# EAGLE design Adafruit PCA9685 (EAGLE 8.2.2)
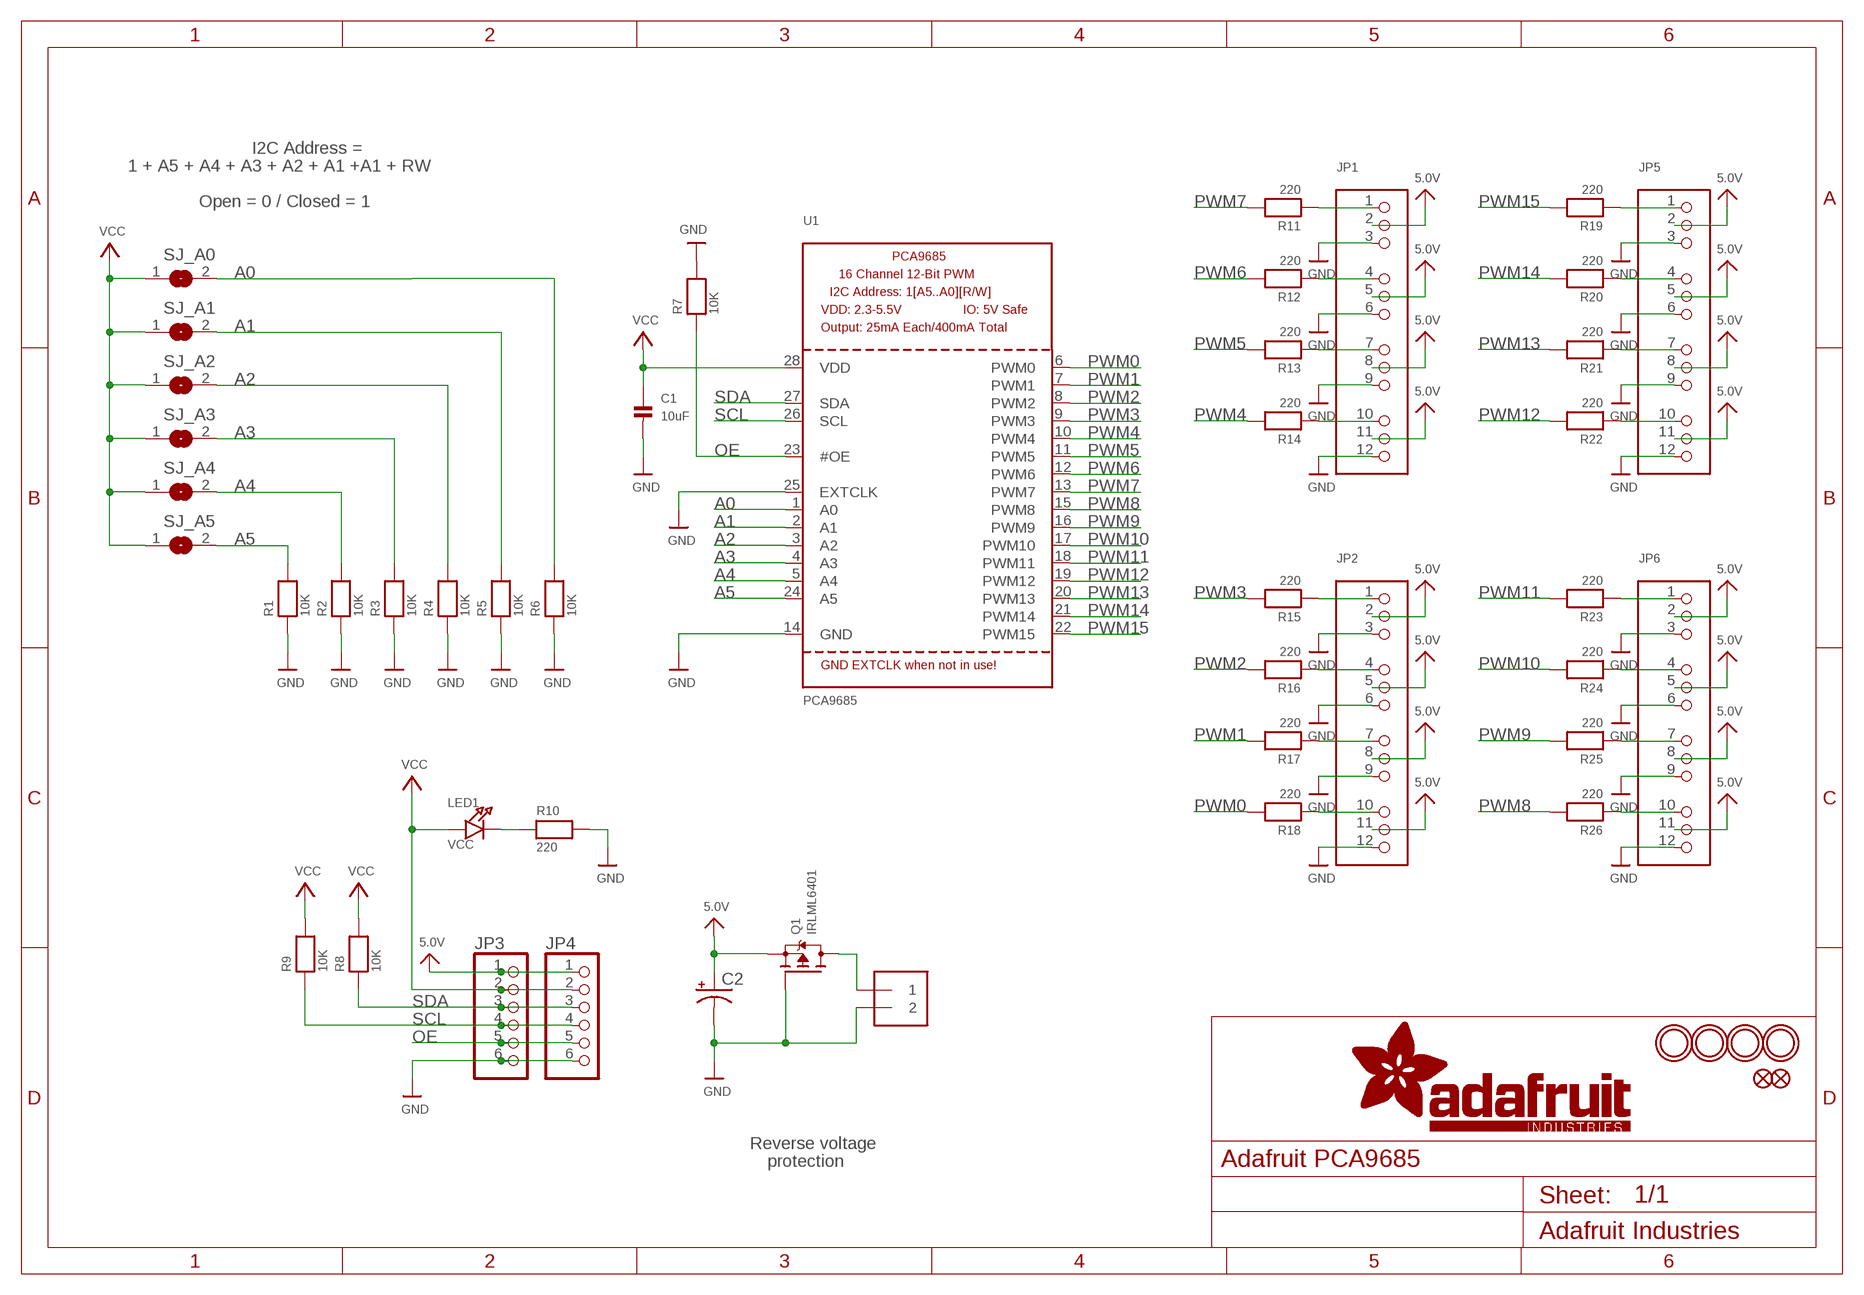
[diagram p0: schematic, sheet 1]

## Parts
C1  10uF  CAP_CERAMIC0805  [0805]
C2  CPOL-USE3.5-8  [E3,5-8]
FID1  FIDUCIAL""  [FIDUCIAL_1MM]
FID2  FIDUCIAL""  [FIDUCIAL_1MM]
J1  TERMBLOCK_1X2-3.5MM  [1X2-3.5MM]
JP1  HEADER-3X04  [3X04]
JP2  HEADER-3X04  [3X04]
JP3  PINHD-1X6CB  [1X06-CLEANBIG]
JP4  PINHD-1X6CB  [1X06-CLEANBIG]
JP5  HEADER-3X04  [3X04]
JP6  HEADER-3X04  [3X04]
LED1  VCC  LED0805  [CHIPLED_0805]
Q1  IRLML6401  MOSFET-PWIDE  [SOT23-WIDE]
R1  10K  RESISTOR0805  [0805]
R2  10K  RESISTOR0805  [0805]
R3  10K  RESISTOR0805  [0805]
R4  10K  RESISTOR0805  [0805]
R5  10K  RESISTOR0805  [0805]
R6  10K  RESISTOR0805  [0805]
R7  10K  RESISTOR0805  [0805]
R8  10K  RESISTOR0805  [0805]
R9  10K  RESISTOR0805  [0805]
R10  220  RESISTOR0805  [0805]
R11  220  RESISTOR0805  [0805]
R12  220  RESISTOR0805  [0805]
R13  220  RESISTOR0805  [0805]
R14  220  RESISTOR0805  [0805]
R15  220  RESISTOR0805  [0805]
R16  220  RESISTOR0805  [0805]
R17  220  RESISTOR0805  [0805]
R18  220  RESISTOR0805  [0805]
R19  220  RESISTOR0805  [0805]
R20  220  RESISTOR0805  [0805]
R21  220  RESISTOR0805  [0805]
R22  220  RESISTOR0805  [0805]
R23  220  RESISTOR0805  [0805]
R24  220  RESISTOR0805  [0805]
R25  220  RESISTOR0805  [0805]
R26  220  RESISTOR0805  [0805]
SJ_A0  SOLDERJUMPERREFLOW_NOPASTE  [SOLDERJUMPER_REFLOW_NOPASTE]
SJ_A1  SOLDERJUMPERREFLOW_NOPASTE  [SOLDERJUMPER_REFLOW_NOPASTE]
SJ_A2  SOLDERJUMPERREFLOW_NOPASTE  [SOLDERJUMPER_REFLOW_NOPASTE]
SJ_A3  SOLDERJUMPERREFLOW_NOPASTE  [SOLDERJUMPER_REFLOW_NOPASTE]
SJ_A4  SOLDERJUMPERREFLOW_NOPASTE  [SOLDERJUMPER_REFLOW_NOPASTE]
SJ_A5  SOLDERJUMPERREFLOW_NOPASTE  [SOLDERJUMPER_REFLOW_NOPASTE]
U1  PCA9685  [TSSOP28]
U$47  MOUNTINGHOLE2.5  [MOUNTINGHOLE_2.5_PLATED]
U$48  MOUNTINGHOLE2.5  [MOUNTINGHOLE_2.5_PLATED]
U$49  MOUNTINGHOLE2.5  [MOUNTINGHOLE_2.5_PLATED]
U$50  MOUNTINGHOLE2.5  [MOUNTINGHOLE_2.5_PLATED]

## Nets
5.0V: C2.+ JP1.2 JP1.5 JP1.8 JP1.11 JP2.2 JP2.5 JP2.8 JP2.11 JP3.1 JP4.1 JP5.2 JP5.5 JP5.8 JP5.11 JP6.2 JP6.5 JP6.8 JP6.11 Q1.2(S)
A0: R6.2 SJ_A0.2 U1.1(A0)
A1: R5.2 SJ_A1.2 U1.2(A1)
A2: R4.2 SJ_A2.2 U1.3(A2)
A3: R3.2 SJ_A3.2 U1.4(A3)
A4: R2.2 SJ_A4.2 U1.5(A4)
A5: R1.2 SJ_A5.2 U1.24(A5)
GND: C1.2 C2.- J1.2 JP1.3 JP1.6 JP1.9 JP1.12 JP2.3 JP2.6 JP2.9 JP2.12 JP3.6 JP4.6 JP5.3 JP5.6 JP5.9 JP5.12 JP6.3 JP6.6 JP6.9 JP6.12 Q1.1(G) R1.1 R2.1 R3.1 R4.1 R5.1 R6.1 R7.2 R10.2 U1.14(GND) U1.25(EXTCLK)
N$1: LED1.C R10.1
N$2: JP1.4 R12.1
N$3: JP1.1 R11.1
N$4: JP1.7 R13.1
N$5: JP1.10 R14.1
N$6: JP2.1 R15.1
N$7: JP2.4 R16.1
N$8: JP2.7 R17.1
N$9: JP2.10 R18.1
N$10: JP6.10 R26.1
N$11: JP6.7 R25.1
N$12: JP6.4 R24.1
N$13: JP6.1 R23.1
N$14: JP5.10 R22.1
N$15: JP5.7 R21.1
N$16: JP5.4 R20.1
N$17: JP5.1 R19.1
OE: JP3.5 JP4.5 R7.1 U1.23(#OE)
PWM0: R18.2 U1.6(PWM0)
PWM1: R17.2 U1.7(PWM1)
PWM2: R16.2 U1.8(PWM2)
PWM3: R15.2 U1.9(PWM3)
PWM4: R14.2 U1.10(PWM4)
PWM5: R13.2 U1.11(PWM5)
PWM6: R12.2 U1.12(PWM6)
PWM7: R11.2 U1.13(PWM7)
PWM8: R26.2 U1.15(PWM8)
PWM9: R25.2 U1.16(PWM9)
PWM10: R24.2 U1.17(PWM10)
PWM11: R23.2 U1.18(PWM11)
PWM12: R22.2 U1.19(PWM12)
PWM13: R21.2 U1.20(PWM13)
PWM14: R20.2 U1.21(PWM14)
PWM15: R19.2 U1.22(PWM15)
PWRIN: J1.1 Q1.3(D)
SCL: JP3.4 JP4.4 R9.1 U1.26(SCL)
SDA: JP3.3 JP4.3 R8.1 U1.27(SDA)
VCC: C1.1 JP3.2 JP4.2 LED1.A R8.2 R9.2 SJ_A0.1 SJ_A1.1 SJ_A2.1 SJ_A3.1 SJ_A4.1 SJ_A5.1 U1.28(VDD)

## Notes on the sheet
- I2C Address =
- 1 + A5 + A4 + A3 + A2 + A1 +A1 + RW
- Open = 0 / Closed = 1
- Reverse voltage
- protection

## Library data of the parts
C1 = microbuilder:CAP_CERAMIC: Ceramic Capacitors 0402 - 0402 Surface Mount Capacitors 16pF 50V 5% [Digikey: 445-4899-2-ND] 18pF 50V 5% [Digikey: 490-1281-2-ND] 22pF 50V 5% [Digikey: 490-1283-2-ND] 68pF 50V 5% [Digikey: 490-1289-2-ND] 0.1uF 10V 10% [Digikey: 490-1318-2-ND] 1.0uF 6.3V 10% [Digikey: 490-1320-2-ND] 0603 - 0603 Surface Mount Capacitors 16 pF 50V 5% [Digikey: 445-5051-2-ND] 22 pF 50V [Digikey: PCC220ACVTR-ND] 33 pF 50V 5% [Digikey: 490-1415-1-ND] 56pF 50V 5% [Digikey: 490-1421-1-ND] 220pF 50V 5% [Digikey: 445-1285-1-ND] 680 pF 50V 2200 pF 50V 5% C0G [Digikey: 445-1297-1-ND] 5600 pF 100V 5% X7R [Digikey: 478-3711-1-ND] 0.1 µF 25V 10% [Digikey: PCC2277TR-ND] 0.22 µF 16V 10% X7R [Digikey: 445-1318-1-ND] 1.0 µF 25V 10% [Digikey: 445-5146-2-ND] 0603 - RF Specific 3pF 250V +/-0.1pF RF [Digikey: 712-1347-1-ND] 18 pF 250V 5% [Digikey: 478-3505-1-ND or 712-1322-1-ND] 56 pF 250V 5% C0G RF [Digikey: 490-4867-1-ND] 68 pF 250V RF [Digikey: 490-4868-1-ND] 0805 - 0805 Surface Mount Capacitors 220 pF 250V 2% RF Ceramic Capacitor [Digikey: 712-1398-1-ND] 1000 pF 50V 2% NP0 Ceramic Capacitor [Digikey: 478-3760-1-ND] 0.1 µF 25V 10% Ceramic Capacitor [Digikey: PCC1828TR-ND] 1.0 µF 16V 10% Ceramic Capacitor[Digikey: 490-1691-2-ND] 10.0 µF 10V 10% Ceramic Capacitor[Digikey: 709-1228-1-ND] 10.0 uF 16V 10% Ceramic Capacitor [Digikey: 478-5165-2-ND] 47 uF 6.3V 20% Ceramic Capacitor [Digikey: 587-1779-1-ND or 399-5506-1-ND] 1206 - 1206 Surface Mount Capacitors 47uF 10V 20% Ceramic Capacitor [Digikey: 490-5528-1-ND or 399-5508-1-ND or 445-6010-1-ND] 100uF 6.3V -20%, +80% Y5V Ceramic Capacitor (Digikey: 490-4512-1-ND, Mouser: 81-GRM31CF50J107ZE1L)
C2 = adafruit:CPOL-US: POLARIZED CAPACITOR, American symbol
FID1 FID2 = microbuilder:FIDUCIAL: Fiducial Alignment Points Various fiducial points for machine vision alignment.
J1 = microbuilder:TERMBLOCK_1X2: 3.5mm Terminal block http://www.ladyada.net/library/pcb/eaglelibrary.html
JP1 JP2 JP5 JP6 = microbuilder:HEADER-3X04
JP3 JP4 = adafruit:PINHD-1X6: PIN HEADER
LED1 = microbuilder:LED: LED 0603 - 0603 Surface Mount Package 2mA: Green LED - Low Power (3.9mcd, 2ma, 1.7Vf) - Digikey: 475-2709-2-ND Orange LED - Low Power (9.8mcd, 2ma, 1.8Vf) - Digikey: 475-1194-2-ND Red LED - Low Power (5mcd, 2ma, 1.8Vf) - Digikey: 475-1195-2-ND Yellow LED - Low Power (7mcd, 2ma, 1.8Vf) - Digikey: 475-1196-2-ND 5mA: Blue LED - Low Power (17mcd, 5ma, 2.9Vf) - Digikey: LNJ937W8CRACT-ND 0805 - 0805 Surface Mount Package 2mA: Red LED (8.8mcd, 2mA, 1.8Vf, Clear) - Low Power [Digikey: 475-2510-1-ND] Green LED (5mcd, 2mA, 1.8Vf, Clear) - Low Power [Digikey: 475-2730-1-ND] Yellow LED (11.3mcd, 2mA, 1.8Vf, Clear) - Low Power [Digikey: 475-2555-1-ND] 20mA: Red LED (104mcd, 20mA, Diffused) - LS R976 [Digikey: 475-1278-6-ND] Red LED (12mcd, 20mA, 2.0Vf, Clear) - APT2012EC [Digikey: 754-1128-1-ND] Green LED (15mcd, 20mA, 2.2Vf, Clear) - APT2012GC [Digikey: 754-1131-1-ND] Orange LED (160mcd, 20mA, 2.1Vf, Clear) - APT2012SECK [Digikey: 754-1130-1-ND] 1206 - 1206 Surface Mount Package Green LED (26mcd, 20mA, Diffused) - LG N971 [Digikey: 475-1407-6-ND] Red LED (15mcd, 20mA, Diffused) - LH N974 [Digikey: 475-1416-6-ND]
Q1 = microbuilder:MOSFET-P: P-Channel Mosfet LEGEND VDS: Voltage Drain-Source ID: Drain Current RDS(ON): Drain-Source On-State Resistance VGS(TH): Gate-Source Threshold Voltage CISS: Drain-Source Input Capacitance SOT-23 Name VDS ID RDS(ON) VGS(TH) CISS Order Number IRLML5103 30V 760mA 600 mOhm -- 75pF @ 25V Digikey: IRLML5103PBFCT-ND NTR0202PL 20V 400mA 800 mOhm 2.3V @ 250uA 70pF @ 5V Digikey: NTR0202PLT1GOSTR-ND NTR4101PT1G 20V 1.8A 85 mOhm 1.2V @ 250uA 675pF @ 10V Digikey: NTR4101PT1GOSCT-ND DMP2004K 20V 600mA 900 mOhm 1V @ 250uA 175pF @ 16V Digikey: DMP2004KDICT-ND PMV65XP 20V 3.9A 76 mOhm 950mV @ 1mA 725pF @ 20V Digikey: 568-2358-2-ND TO-252 Name VDS ID RDS(ON) VGS(TH) CISS Order Number AOD417 30V 25A 34 mOhm 3V @ 250µA 920pF @ 15V Digikey: 785-1106-2-ND
R1-R26 = microbuilder:RESISTOR: Resistors 0402 - 0402 Surface Mount Package 22 Ohm 1% 1/16W [Digikey: 311-22.0LRTR-ND] 33 Ohm 5% 1/16W 1.0K 5% 1/16W 1.5K 5% 1/16W 2.0K 1% 1/16W 10.0K 1% 1/16W [Digikey: 311-10.0KLRTR-ND] 10.0K 5% 1/16W [Digikey: RMCF0402JT10K0TR-ND] 12.1K 1% 1/16W [Digikey: 311-22.0LRTR-ND] 100.0K 5% 1/16W 0603 - 0603 Surface Mount Package 0 Ohm 1/10 Watt 1% Resistor 15 Ohm 1/10 Watt 1% Resistor 33 Ohm 1/10 Watt 1% Resistor 49.9 Ohm 1/10 Watt 1% Resistor 100 Ohm 1/10 Watt 1% Resistor 150 Ohm 1/10 Watt 1% Resistor 240 Ohm 1/10 Watt 1% Resistor 390 Ohm 1/10 Watt 1% Resistor 560 Ohm 1/10 Watt 1% Resistor 680 Ohm 1/10 Watt 1% Resistor 750 Ohm 1/10 Watt 1% Resistor 1.0K Ohm 1/10 Watt 1% Resistor 1.5K Ohm 1/10 Watt 1% Resistor 2.0K Ohm 1/10 Watt 1% Resistor 2.2K Ohm 1/10 Watt 1% Resistor 3.3K Ohm 1/10 Watt 1% Resistor 4.7K Ohm 1/10 Watt 1% Resistor 10.0K Ohm 1/10 Watt 1% Resistor 12.0K Ohm 1/10 Watt 1% Resistor 12.1K Ohm 1/10 Watt 1% Resistor 20.0K Ohm 1/10 Watt 1% Resistor 33.0K Ohm 1/10 Watt 1% Resistor 100.0K Ohm 1/10 Watt 1% Resistor 0805 - 0805 Surface Mount Package 0 Ohm 1/8 Watt 1% Resistor 33 Ohm 1/8 Watt 1% Resistor 100 Ohm 1/8 Watt 1% Resistor 150 Ohm 1/8 Watt 1% Resistor 200 Ohm 1/8 Watt 1% Resistor 240 Ohm 1/8 Watt 1% Resistor 330 Ohm 1/8 Watt 1% Resistor 390 Ohm 1/8 Watt 1% Resistor 470 Ohm 1/8 Watt 1% Resistor 1.0K Ohm 1/8 Watt 1% Resistor 1.5K Ohm 1/8 Watt 1% Resistor 2.0K Ohm 1/8 Watt 1% Resistor 4.7K Ohm 1/8 Watt 1% Resistor 5.1K Ohm 1/8 Watt 1% Resistor 5.6K Ohm 1/8 Watt 1% Resistor 10.0K Ohm 1/8 Watt 1% Resistor 22.0K Ohm 1/8 Watt 1% Resistor 33.0K Ohm 1/8 Watt 1% Resistor 100K Ohm 1/8 Watt 1% Resistor 1206 - 1206 Surface Mount Package 2012 - 2010 Surface Mount Package 0.11 Ohm 1/2 Watt 1% Resistor - Digikey: RHM.11UCT-ND
SJ_A0 SJ_A1-SJ_A5 = microbuilder:SOLDERJUMPER: SMD Solder JUMPER Solder the two pads together to create a connection, or remove the solder to break it. REFLOW - Use this footprint for solder paste and reflow ovens. WAVE - Use this footprint for hand-soldering (larger pads). CLOSED - Has a trace between the two pads to ensure it is closed by default. The trace needs to be cut to disable the jumper, and can be closed again by creating a solder bridge between the two pads.
U1 = microbuilder:PCA9685: PCA9685 - 16 Channel 12-Bit I2C PWM Controller 5.0V tolerant 16 channel, 12-bit I2C PWM controller with 25mA per output (max. 400mA total) Digikey: 568-5931-1-ND
U$47-U$50 = microbuilder:MOUNTINGHOLE: Mounting Hole For #2 screws (0.086"/2.18mm width, 0.094"/2.4mm hole) use 2.5mm

## Board
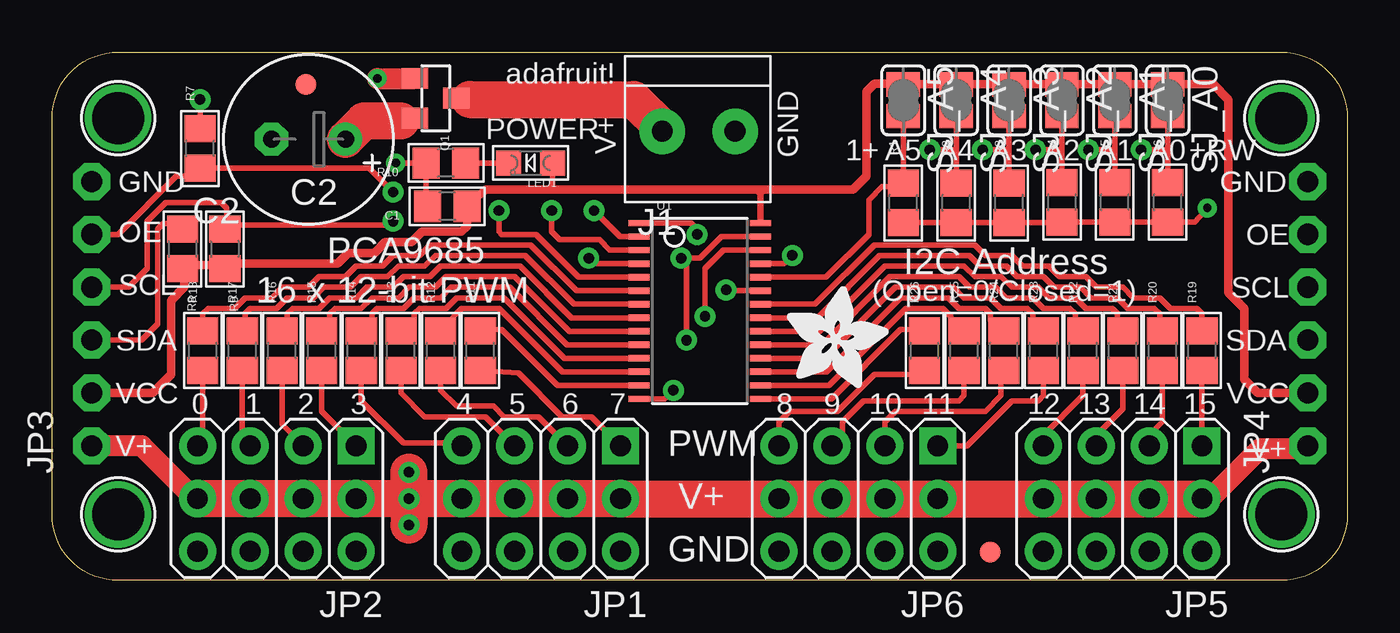
[diagram p1: board, top side]
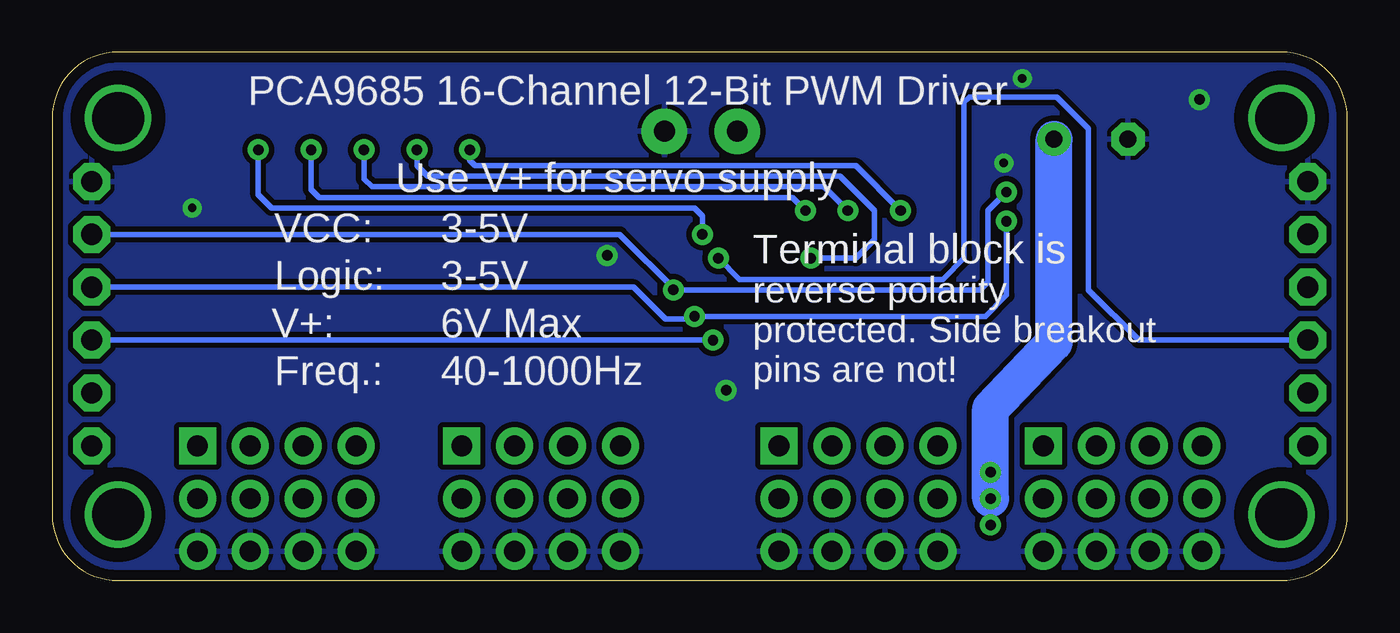
[diagram p2: board, bottom side, seen from below]

Size 62.23 x 25.4 mm. Coordinates in mm from the lower left corner, seen from the top.
Outline: 3.17,0 arc-90 0,3.17 0,22.23 arc-90 3.17,25.4 59.05,25.4 arc-90 62.23,22.23 62.23,3.17 arc-90 59.05,0 3.17,0
Copper layers (1*16): Top 0.035mm / dielectric 1.5mm / Bottom 0.035mm
Design rules "PCBCart-Standard": minimum track width 8mil, minimum drill 0.4mm, track to track 8mil, track to pad 8mil, pad to pad 8mil, via to via 8mil, smd to smd 8mil, copper to edge 20mil, drill to drill 8mil, minimum pad ring 8mil, minimum via ring 10mil, stop-mask expansion 3mil, vias tented up to drill 20mil, thermal gap 8mil

### Footprints (pad centres in the part's own frame; a part is rotated, then mirrored left to right if it is on the bottom)
0805 = smd 1.3 x 1.5: 1 -0.95,0; 2 0.95,0
E3,5-8 = drill 0.813 pad 1.6 round: + -1.778,0 | drill 0.813 pad 1.6 octagon: - 1.778,0
FIDUCIAL_1MM = smd 1 x 1: 1 0,0
1X2-3.5MM = drill 1 pad 2.184 round: 1 1.8,0; 2 -1.7,0
3X04 = drill 1 pad 1.778 square: 1 -3.81,-2.54 | drill 1 pad 1.778 round: 2 -3.81,0; 3 -3.81,2.54; 4 -1.27,-2.54; 5 -1.27,0; 6 -1.27,2.54; 7 1.27,-2.54; 8 1.27,0; 9 1.27,2.54; 10 3.81,-2.54; 11 3.81,0; 12 3.81,2.54
1X06-CLEANBIG = drill 1.016 pad 1.778 octagon: 1 -6.35,0; 2 -3.81,0; 3 -1.27,0; 4 1.27,0; 5 3.81,0; 6 6.35,0
CHIPLED_0805 = smd 1.2 x 1.2: A 0,-1.05; C 0,1.05
SOT23-WIDE = smd 1 x 1.27: 1 -0.95,-1; 2 0.95,-1; 3 0,1
SOLDERJUMPER_REFLOW_NOPASTE = smd 1.168 x 1.6: 1 -0.762,0; 2 0.762,0
TSSOP28 = smd 0.305 x 0.991: 1 -4.225,-2.918; 2 -3.575,-2.918; 3 -2.925,-2.918; 4 -2.275,-2.918; 5 -1.625,-2.918; 6 -0.975,-2.918; 7 -0.325,-2.918; 8 0.325,-2.918; 9 0.975,-2.918; 10 1.625,-2.918; 11 2.275,-2.918; 12 2.925,-2.918; 13 3.575,-2.918; 14 4.225,-2.918; 15 4.225,2.918; 16 3.575,2.918; 17 2.925,2.918; 18 2.275,2.918; 19 1.625,2.918; 20 0.975,2.918; 21 0.325,2.918; 22 -0.325,2.918; 23 -0.975,2.918; 24 -1.625,2.918; 25 -2.275,2.918; 26 -2.925,2.918; 27 -3.575,2.918; 28 -4.225,2.918
MOUNTINGHOLE_2.5_PLATED = drill 2.5 pad 3.2 round: P$1 0,0

### Placement (x,y rotation side)
C1  18.99,17.99 180 top
C2  12.32,21.21 180 top
FID1  45.07,1.36 0 top
FID2  12.19,23.85 0 top
J1  31.11,21.59 180 top
JP1  23.49,3.94 180 top
JP2  10.79,3.94 180 top
JP3  1.9,12.83 90 top
JP4  60.33,12.83 90 top
JP5  51.44,3.94 180 top
JP6  38.73,3.94 180 top
LED1  22.99,20.07 90 top
Q1  18.43,23.18 270 top
R1  40.89,18.14 90 top
R2  43.43,18.14 90 top
R3  45.97,18.14 90 top
R4  48.51,18.18 90 top
R5  51.05,18.18 90 top
R6  53.59,18.18 90 top
R7  7.11,20.76 90 top
R8  6.27,15.94 270 top
R9  8.3,15.94 270 top
R10  18.92,20.07 180 top
R11  20.57,11.05 90 top
R12  18.67,11.05 90 top
R13  16.76,11.05 90 top
R14  14.86,11.05 90 top
R15  12.95,11.05 90 top
R16  11.05,11.05 90 top
R17  9.14,11.05 90 top
R18  7.24,11.05 90 top
R19  55.24,11.05 90 top
R20  53.34,11.05 90 top
R21  51.44,11.05 90 top
R22  49.53,11.05 90 top
R23  47.62,11.05 90 top
R24  45.72,11.05 90 top
R25  43.81,11.05 90 top
R26  41.91,11.05 90 top
SJ_A0  53.59,23.08 270 top
SJ_A1  51.05,23.08 270 top
SJ_A2  48.51,23.08 270 top
SJ_A3  45.97,23.08 270 top
SJ_A4  43.43,23.08 270 top
SJ_A5  40.89,23.08 270 top
U1  31.11,12.95 270 top
U$47  3.17,22.23 0 top
U$48  3.17,3.17 0 top
U$49  59.05,22.23 0 top
U$50  59.05,3.17 0 top
U$51  [ADAFRUIT_5MM]  35.31,9.27 0 top

### Tracks (layer width: path | path; a pad name or v marks a point on that pad's centre or on a via)
5.0V  (via drill 0.5)
  Top 0.254: 16.76,22.1 17.3,22.1 Q1.2 | JP2.11 6.86,3.94 | JP5.2 55.63,3.94
  Top 1.016: JP3.1 4.32,6.48 6.86,3.94 | 55.63,3.94 58.04,6.35 60.2,6.35 JP4.1
  Top 1.778: JP2.11 JP2.8 JP2.5 JP2.2 v17.14,3.94 | v17.14,3.94 JP1.11 JP1.8 JP1.5 JP1.2 JP6.11 JP6.8 JP6.5 JP6.2 JP5.11 JP5.8 JP5.5 JP5.2 | C2.+ 14.99,22.1 16.76,22.1 | v17.14,3.94 v17.14,5.21 | v17.14,3.94 v17.14,2.67
  Bottom 1.778: C2.+ 14.1,11.43 17.14,8.26 v17.14,3.94
A0  (via drill 0.5)
  Top 0.254: 53.59,20.7 SJ_A0.2 | v52.32,20.7 53.59,20.7 | 53.59,20.7 R6.2 | v30.99,16.64 30.99,16.89 30.7,17.18 U1.1
  Bottom 0.254: v52.32,20.7 52.32,18.54 51.69,17.91 31.37,17.91 30.99,17.53 v30.99,16.64
A1  (via drill 0.5)
  Top 0.254: 51.05,20.7 SJ_A1.2 | v49.78,20.7 51.05,20.7 | 51.05,20.7 R5.2 | U1.2 27.29,16.53 v26.03,17.78
  Bottom 0.254: v49.78,20.7 49.78,18.8 49.4,18.41 26.67,18.41 v26.03,17.78
A2  (via drill 0.5)
  Top 0.254: 48.51,20.7 SJ_A2.2 | v47.24,20.7 48.51,20.7 | 48.51,20.7 R4.2 | U1.3 26.79,15.88 26.29,16.38 24.38,16.38 24,16.76 v24,17.78
  Bottom 0.254: v47.24,20.7 47.24,19.3 46.86,18.92 25.15,18.92 v24,17.78
A3  (via drill 0.5)
  Top 0.254: 45.97,20.7 SJ_A3.2 | v44.7,20.7 45.97,20.7 | 45.97,20.7 R3.2 | U1.4 26.05,15.23 v25.78,15.49
  Bottom 0.254: v44.7,20.7 44.7,19.94 44.2,19.43 24.38,19.43 22.73,17.78 22.73,16.38 23.62,15.49 v25.78,15.49
A4  (via drill 0.5)
  Top 0.254: 43.43,20.7 SJ_A4.2 | v42.16,20.7 43.43,20.7 | 43.43,20.7 R2.2 | v21.46,17.78 21.46,16.76 21.59,16.64 23.24,16.64 25.3,14.58 U1.5
  Bottom 0.254: v42.16,20.7 42.16,20.19 41.91,19.94 23.62,19.94 v21.46,17.78
A5
  Top 0.254: U1.24 37.19,14.58 39.24,16.64 39.24,18.29 39.88,18.92 40.72,18.92 R1.2 SJ_A5.2
GND  (via drill 0.4, 0.5)
  Top 0.254: v15.62,24.13 15.65,23.85 | R1.1 R2.1 R3.1 48.48,17.2 R4.1 R5.1 R6.1 54.91,17.23 v55.5,17.91 | v16.51,20.07 R10.2 17.97,18.05 C1.2 | v7.11,23.11 R7.2 | U1.14 29.43,8.73 v29.84,9.14 | U1.25 35.17,15.23 v35.56,15.62
  Top 1.016: Q1.1 v15.62,24.13
  Bottom 0.254: v7.11,23.11 7.24,22.86 | v35.56,15.62 35.81,15.62
  pour Bottom (isolate 0.254): 0,0 0,25.94 62.78,25.94 62.78,0
N$1
  Top 0.254: R10.1 LED1.C
N$2
  Top 0.254: R12.1 18.67,9.14 19.43,8.38 21.21,8.38 21.72,7.87 23.37,7.87 JP1.4
N$3
  Top 0.254: R11.1 22.41,9.97 24.51,7.87 25.91,7.87 JP1.1
N$4
  Top 0.254: R13.1 16.76,9.02 17.91,7.87 20.83,7.87 JP1.7
N$5
  Top 0.254: R14.1 14.86,8.64 16.89,6.6 19.56,6.6 JP1.10
N$6
  Top 0.254: R15.1 12.95,8.13 JP2.1
N$7
  Top 0.254: R16.1 11.05,7.49 JP2.4
N$8
  Top 0.254: R17.1 9.14,6.86 JP2.7
N$9
  Top 0.254: R18.1 7.24,6.73 JP2.10
N$10
  Top 0.254: JP6.10 34.92,7.62 35.43,8.13 37.72,8.13 39.5,9.91 41.84,9.91 R26.1
N$11
  Top 0.254: R25.1 43.81,8.89 43.56,8.64 38.99,8.64 37.97,7.62 37.97,6.99 JP6.7
N$12
  Top 0.254: R24.1 45.59,9.85 45.59,8.89 44.83,8.13 40.51,8.13 40,7.62 JP6.4
N$13
  Top 0.254: R23.1 47.62,8.89 47.37,8.64 46.1,8.64 43.94,6.48 JP6.1
N$14
  Top 0.254: R22.1 49.53,8.89 47.62,6.99 JP5.10
N$15
  Top 0.254: R21.1 51.44,8.26 50.16,6.99 JP5.7
N$16
  Top 0.254: R20.1 53.34,7.62 52.7,6.99 JP5.4
N$17
  Top 0.254: JP5.1 R19.1
OE  (via drill 0.5)
  Top 0.254: JP3.5 3.17,16.64 5.97,19.43 6.98,19.43 R7.1 15.24,19.81 v16.38,18.67 | U1.23 32.43,13.93 v32.38,13.97
  Bottom 0.254: JP4.5 34.97,16.64 32.26,13.93 32.43,13.93 v32.38,13.97 17.65,13.97 17.27,14.35 17.27,17.78 v16.38,18.67
PWM0
  Top 0.254: R18.2 7.24,12.83 7.49,13.08 8.76,13.08 9.27,13.59 10.54,13.59 11.05,14.1 12.32,14.1 12.83,14.61 14.1,14.61 14.6,15.11 15.87,15.11 16.38,15.62 17.65,15.62 18.16,16.13 22.99,16.13 25.19,13.93 U1.6
PWM1
  Top 0.254: R17.2 9.27,12.13 9.27,12.83 9.52,13.08 10.79,13.08 11.3,13.59 12.57,13.59 13.08,14.1 14.35,14.1 14.86,14.61 16.13,14.61 16.64,15.11 17.91,15.11 18.41,15.62 22.73,15.62 25.07,13.28 U1.7
PWM2
  Top 0.254: R16.2 11.3,12.25 11.3,12.83 11.56,13.08 12.83,13.08 13.33,13.59 14.6,13.59 15.11,14.1 16.38,14.1 16.89,14.61 18.16,14.61 18.67,15.11 22.48,15.11 24.96,12.63 U1.8
PWM3
  Top 0.254: R15.2 13.33,12.38 13.33,12.83 13.59,13.08 14.86,13.08 15.37,13.59 16.64,13.59 17.14,14.1 18.41,14.1 18.92,14.61 22.22,14.61 24.85,11.98 U1.9
PWM4
  Top 0.254: R14.2 15.37,12.51 15.37,12.83 15.62,13.08 16.89,13.08 17.4,13.59 18.67,13.59 19.18,14.1 21.97,14.1 24.74,11.33 U1.10
PWM5
  Top 0.254: R13.2 17.4,12.38 17.4,12.83 17.65,13.08 18.92,13.08 19.43,13.59 21.72,13.59 24.63,10.68 U1.11
PWM6
  Top 0.254: R12.2 19.43,12.83 19.68,13.08 21.46,13.08 24.52,10.03 U1.12
PWM7
  Top 0.254: U1.13 24.28,9.38 21.59,12.06 20.64,12.06 R11.2
PWM8
  Top 0.254: U1.15 37.43,8.73 40.77,12.06 41.72,12.06 R26.2
PWM9
  Top 0.254: U1.16 37.32,9.38 41.02,13.08 42.8,13.08 43.18,12.7 43.18,12.51 R25.2
PWM10
  Top 0.254: U1.17 37.21,10.03 40.77,13.59 43.05,13.59 43.56,13.08 44.83,13.08 45.09,12.83 45.09,12.51 R24.2
PWM11
  Top 0.254: U1.18 37.09,10.68 40.51,14.1 43.31,14.1 43.81,13.59 45.09,13.59 45.59,13.08 46.86,13.08 47.12,12.83 47.12,12.38 R23.2
PWM12
  Top 0.254: U1.19 36.98,11.33 40.26,14.61 43.56,14.61 44.07,14.1 45.34,14.1 45.85,13.59 47.12,13.59 47.62,13.08 48.89,13.08 49.15,12.83 49.15,12.25 R22.2
PWM13
  Top 0.254: U1.20 36.87,11.98 40,15.11 43.81,15.11 44.32,14.61 45.59,14.61 46.1,14.1 47.37,14.1 47.88,13.59 49.15,13.59 49.66,13.08 50.93,13.08 51.18,12.83 51.18,12.13 R21.2
PWM14
  Top 0.254: U1.21 36.76,12.63 39.75,15.62 44.07,15.62 44.58,15.11 45.85,15.11 46.35,14.61 47.62,14.61 48.13,14.1 49.4,14.1 49.91,13.59 51.18,13.59 51.69,13.08 52.96,13.08 53.21,12.83 53.21,12 R20.2
PWM15
  Top 0.254: U1.22 36.65,13.28 39.5,16.13 44.32,16.13 44.83,15.62 46.1,15.62 46.61,15.11 47.88,15.11 48.39,14.61 49.66,14.61 50.16,14.1 51.44,14.1 51.94,13.59 53.21,13.59 53.72,13.08 54.99,13.08 55.24,12.83 R19.2
PWRIN
  Top 0.254: 20.07,23.11 19.49,23.11 Q1.3
  Top 1.778: J1.1 29.31,21.74 27.94,23.11 20.07,23.11
SCL  (via drill 0.5)
  Top 0.254: JP3.4 3.68,14.1 4.57,14.99 4.57,17.27 5.46,18.16 8.13,18.16 8.38,17.91 8.38,17.09 | 8.38,17.09 R9.1 | v31.37,12.7 31.37,14.99 32.26,15.88 U1.26 | 8.38,17.09 16.21,17.09 v16.38,17.27
  Bottom 0.254: JP4.4 34.29,14.1 32.77,12.57 31.5,12.57 v31.37,12.7 17.4,12.7 16.38,13.72 v16.38,17.27
SDA  (via drill 0.5)
  Top 0.254: R8.1 6.27,17.14 5.33,17.14 5.08,16.89 5.08,12.32 4.32,11.56 JP3.3 | U1.27 32.15,16.53 31.11,15.49 v30.23,15.49 30.48,15.24 v30.48,11.56
  Bottom 0.254: v30.48,11.56 JP4.3 | JP3.3 10.03,11.56 12.45,13.97 12.45,21.72 13.97,23.24 18.16,23.24 18.41,22.99 18.41,15.49 19.43,14.48 29.21,14.48 v30.23,15.49
VCC
  Top 0.254: LED1.A 24.04,18.83 24,18.8
  Top 0.305: 34.03,18.67 U1.28
  Top 0.406: JP3.2 4.83,9.02 5.71,9.91 5.71,13.46 6.35,14.1 6.35,15.16 | 33.91,18.8 24,18.8 20.83,18.8 20.57,18.54 20.49,18.54 C1.1 19.94,17.02 19.68,16.76 17.78,16.76 17.27,16.26 16,16.26 15.49,15.75 14.22,15.75 13.72,15.24 8.3,15.24 R9.2 8.22,15.16 6.35,15.16 | 33.91,18.8 38.48,18.8 39.12,19.43 39.12,23.5 39.5,23.88 40.86,23.88 SJ_A5.1 SJ_A4.1 SJ_A3.1 SJ_A2.1 SJ_A1.1 SJ_A0.1 55.78,23.84 56.52,23.11 56.52,13.84 57.28,13.08 57.28,9.65 57.91,9.02 JP4.2 | 33.91,18.8 34.03,18.67 | 6.35,15.16 R8.2

### Text on the board
tPlace: adafruit! | POWER | V+ | GND | 1+ | A5 | A4 | A3 | A2 | A1 | A0 | +RW | GND | GND | C2 | OE | OE | PCA9685 | I2C Address | SCL | SCL | 16 x 12-bit PWM | (Open=0/Closed=1) | SDA | SDA | VCC | VCC | 0 | 1 | 2 | 3 | 4 | 5 | 6 | 7 | 8 | 9 | 10 | 11 | 12 | 13 | 14 | 15 | V+ | V+ | PWM | V+ | GND
bPlace: PCA9685 16-Channel 12-Bit PWM Driver | Use V+ for servo supply | 3-5V | VCC: | Terminal block is | 3-5V | Logic: | reverse polarity | 6V Max | V+: | protected. Side breakout | pins are not! | 40-1000Hz | Freq.: